# Altium schematic sheet AC Plug Power.SchDoc
size A4; SheetNumber: 5; SheetTotal: 5
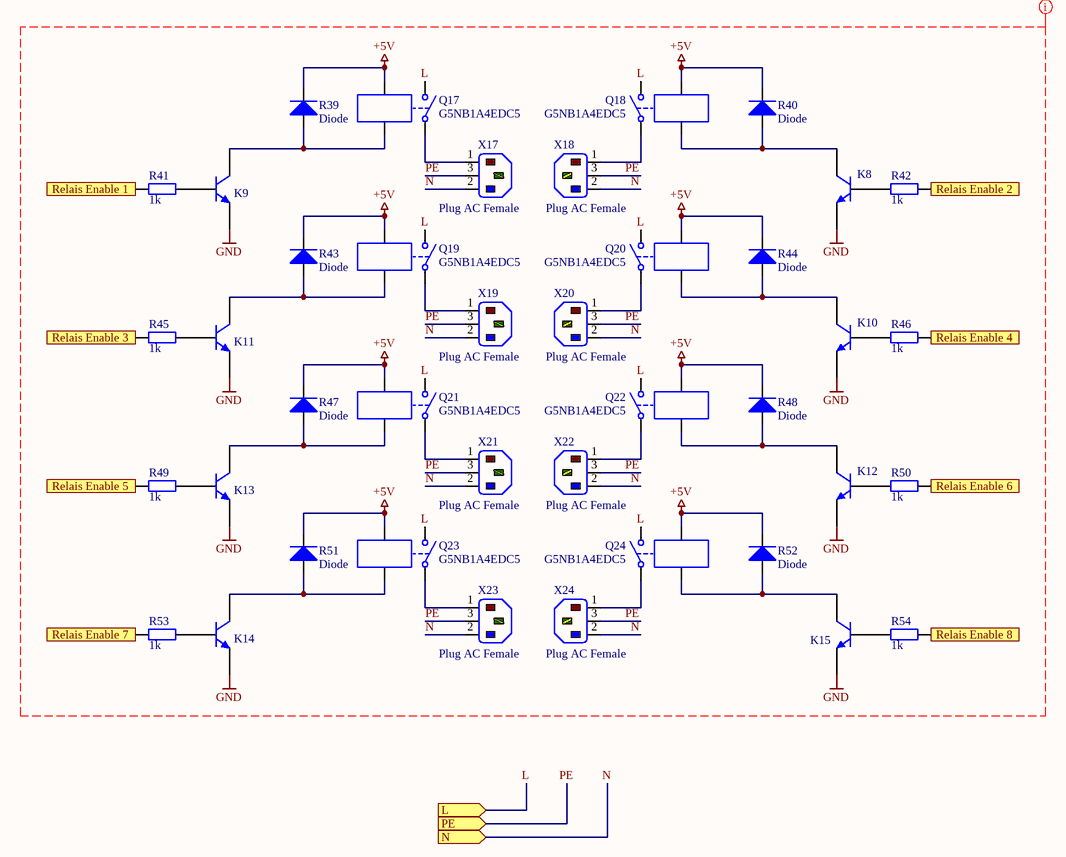
[diagram p0: AC Plug Power.SchDoc]

## Parts
K8  BC817-16-7-F  [SOT23-3]  (value not drawn)
K9  BC817-16-7-F  [SOT23-3]  (value not drawn)
K10  BC817-16-7-F  [SOT23-3]  (value not drawn)
K11  BC817-16-7-F  [SOT23-3]  (value not drawn)
K12  BC817-16-7-F  [SOT23-3]  (value not drawn)
K13  BC817-16-7-F  [SOT23-3]  (value not drawn)
K14  BC817-16-7-F  [SOT23-3]  (value not drawn)
K15  BC817-16-7-F  [SOT23-3]  (value not drawn)
Q17  G5NB1A4EDC5  [G5NB1A4DC5]
Q18  G5NB1A4EDC5  [G5NB1A4DC5]
Q19  G5NB1A4EDC5  [G5NB1A4DC5]
Q20  G5NB1A4EDC5  [G5NB1A4DC5]
Q21  G5NB1A4EDC5  [G5NB1A4DC5]
Q22  G5NB1A4EDC5  [G5NB1A4DC5]
Q23  G5NB1A4EDC5  [G5NB1A4DC5]
Q24  G5NB1A4EDC5  [G5NB1A4DC5]
R39  Diode  [DIOMELF3515N]
R40  Diode  [DIOMELF3515N]
R41  value 1k  [RESMELF3514N]  (hidden comment: Resistor)
R42  value 1k  [RESMELF3514N]  (hidden comment: Resistor)
R43  Diode  [DIOMELF3515N]
R44  Diode  [DIOMELF3515N]
R45  value 1k  [RESMELF3514N]  (hidden comment: Resistor)
R46  value 1k  [RESMELF3514N]  (hidden comment: Resistor)
R47  Diode  [DIOMELF3515N]
R48  Diode  [DIOMELF3515N]
R49  value 1k  [RESMELF3514N]  (hidden comment: Resistor)
R50  value 1k  [RESMELF3514N]  (hidden comment: Resistor)
R51  Diode  [DIOMELF3515N]
R52  Diode  [DIOMELF3515N]
R53  value 1k  [RESMELF3514N]  (hidden comment: Resistor)
R54  value 1k  [RESMELF3514N]  (hidden comment: Resistor)
X17  Plug AC Female  [282841-3]
X18  Plug AC Female  [282841-3]
X19  Plug AC Female  [282841-3]
X20  Plug AC Female  [282841-3]
X21  Plug AC Female  [282841-3]
X22  Plug AC Female  [282841-3]
X23  Plug AC Female  [282841-3]
X24  Plug AC Female  [282841-3]

## Ports
L (in), N (in), PE (in), Relais Enable 1 (in), Relais Enable 2 (in), Relais Enable 3 (in), Relais Enable 4 (in), Relais Enable 5 (in), Relais Enable 6 (in), Relais Enable 7 (in), Relais Enable 8 (in)

## Nets
+5V: Q17.4 Q18.4 Q19.4 Q20.4 Q21.4 Q22.4 Q23.4 Q24.4 R39.C(Cathode) R40.C(Cathode) R43.C(Cathode) R44.C(Cathode) R47.C(Cathode) R48.C(Cathode) R51.C(Cathode) R52.C(Cathode)
GND: K8.2(E) K9.2(E) K10.2(E) K11.2(E) K12.2(E) K13.2(E) K14.2(E) K15.2(E)
L: Q17.2 Q18.2 Q19.2 Q20.2 Q21.2 Q22.2 Q23.2 Q24.2 ; port L
N: X17.2(N) X18.2(N) X19.2(N) X20.2(N) X21.2(N) X22.2(N) X23.2(N) X24.2(N) ; port N
PE: X17.3(E) X18.3(E) X19.3(E) X20.3(E) X21.3(E) X22.3(E) X23.3(E) X24.3(E) ; port PE
Relais Enable 1: R41.1 ; port Relais Enable 1
Relais Enable 2: R42.2 ; port Relais Enable 2
Relais Enable 3: R45.1 ; port Relais Enable 3
Relais Enable 4: R46.2 ; port Relais Enable 4
Relais Enable 5: R49.1 ; port Relais Enable 5
Relais Enable 6: R50.2 ; port Relais Enable 6
Relais Enable 7: R53.1 ; port Relais Enable 7
Relais Enable 8: R54.2 ; port Relais Enable 8
NetK8_1: K8.1(B) R42.1
NetK8_3: K8.3(C) Q18.3 R40.A(Anode)
NetK9_1: K9.1(B) R41.2
NetK9_3: K9.3(C) Q17.3 R39.A(Anode)
NetK10_1: K10.1(B) R46.1
NetK10_3: K10.3(C) Q20.3 R44.A(Anode)
NetK11_1: K11.1(B) R45.2
NetK11_3: K11.3(C) Q19.3 R43.A(Anode)
NetK12_1: K12.1(B) R50.1
NetK12_3: K12.3(C) Q22.3 R48.A(Anode)
NetK13_1: K13.1(B) R49.2
NetK13_3: K13.3(C) Q21.3 R47.A(Anode)
NetK14_1: K14.1(B) R53.2
NetK14_3: K14.3(C) Q23.3 R51.A(Anode)
NetK15_1: K15.1(B) R54.1
NetK15_3: K15.3(C) Q24.3 R52.A(Anode)
NetQ17_1: Q17.1 X17.1(L)
NetQ18_1: Q18.1 X18.1(L)
NetQ19_1: Q19.1 X19.1(L)
NetQ20_1: Q20.1 X20.1(L)
NetQ21_1: Q21.1 X21.1(L)
NetQ22_1: Q22.1 X22.1(L)
NetQ23_1: Q23.1 X23.1(L)
NetQ24_1: Q24.1 X24.1(L)

## Notes on the sheet
- Bahnhöheweg 70
- ICT Berufsbildungscenter AG
- Bereich Elektronik
- Datum:
- Version:
- Blattgrösse:
- Blattnummer:
- A4
- /
- 3018 Bern
- Dateiname:

## Library data of the parts
K8-K15 = BC817-16-7-F: Transistor NPN in SOT23-3 package; Supplier 1: Mouser; Supplier Part Number 1: 621-BC817-16-7-F
Q17-Q24 = Relay-SPST: Single-Pole Single-Throw Relay; Published: 24-Mar-1999; LatestRevisionDate: 17-Jul-2002; LatestRevisionNote: Re-released for DXP Platform.; PackageReference: MODULE4; Publisher: Altium Limited
X17-X24 = Plug AC Male: IEC Mains Power Inlet, EN60 320-1 C14 Class I Cold Condition, PC Flange Rear Mount, Chassis Plug; PackageDocument: ver.80, 15-Sep-2003; MaximumRating: 10A, 250V a.c. (UL & CSA 15A, 250V a.c.); MountingFixtures: Not drawn on schematic symbol.; PCB_Layout: Complies with manufacturer's recommendation.; DrillSize: Corresponds to nominal value.; Note: IEC Color Scheme employed for L, N and E.; Published: 15-Jul-2004; LatestRevisionDate: 15-Jul-2004; LatestRevisionNote: Component Replaced.; DatasheetDocument: ver.80, 15-Sep-2003; PackageReference: PX0580/PC; Publisher: Altium Limited; Terminations: P.C. Spills; ComponentLink1Description: Manufacturer Link; ComponentLink1URL: http://www.bulgin.co.uk/
R39 R40 R43 R44 R47 R48 R51 R52 = Diode: LatestRevisionDate: 03.04.2019; Publisher: ICT Berufsbildungscenter AG
R41 R42 R45 R46 R49 R50 R53 R54 = Resistor: LatestRevisionDate: 02.04.2019; Publisher: ICT Berufsbildungscenter AG